# Altium project 191212 Temperature Sensors R0.PrjPcb
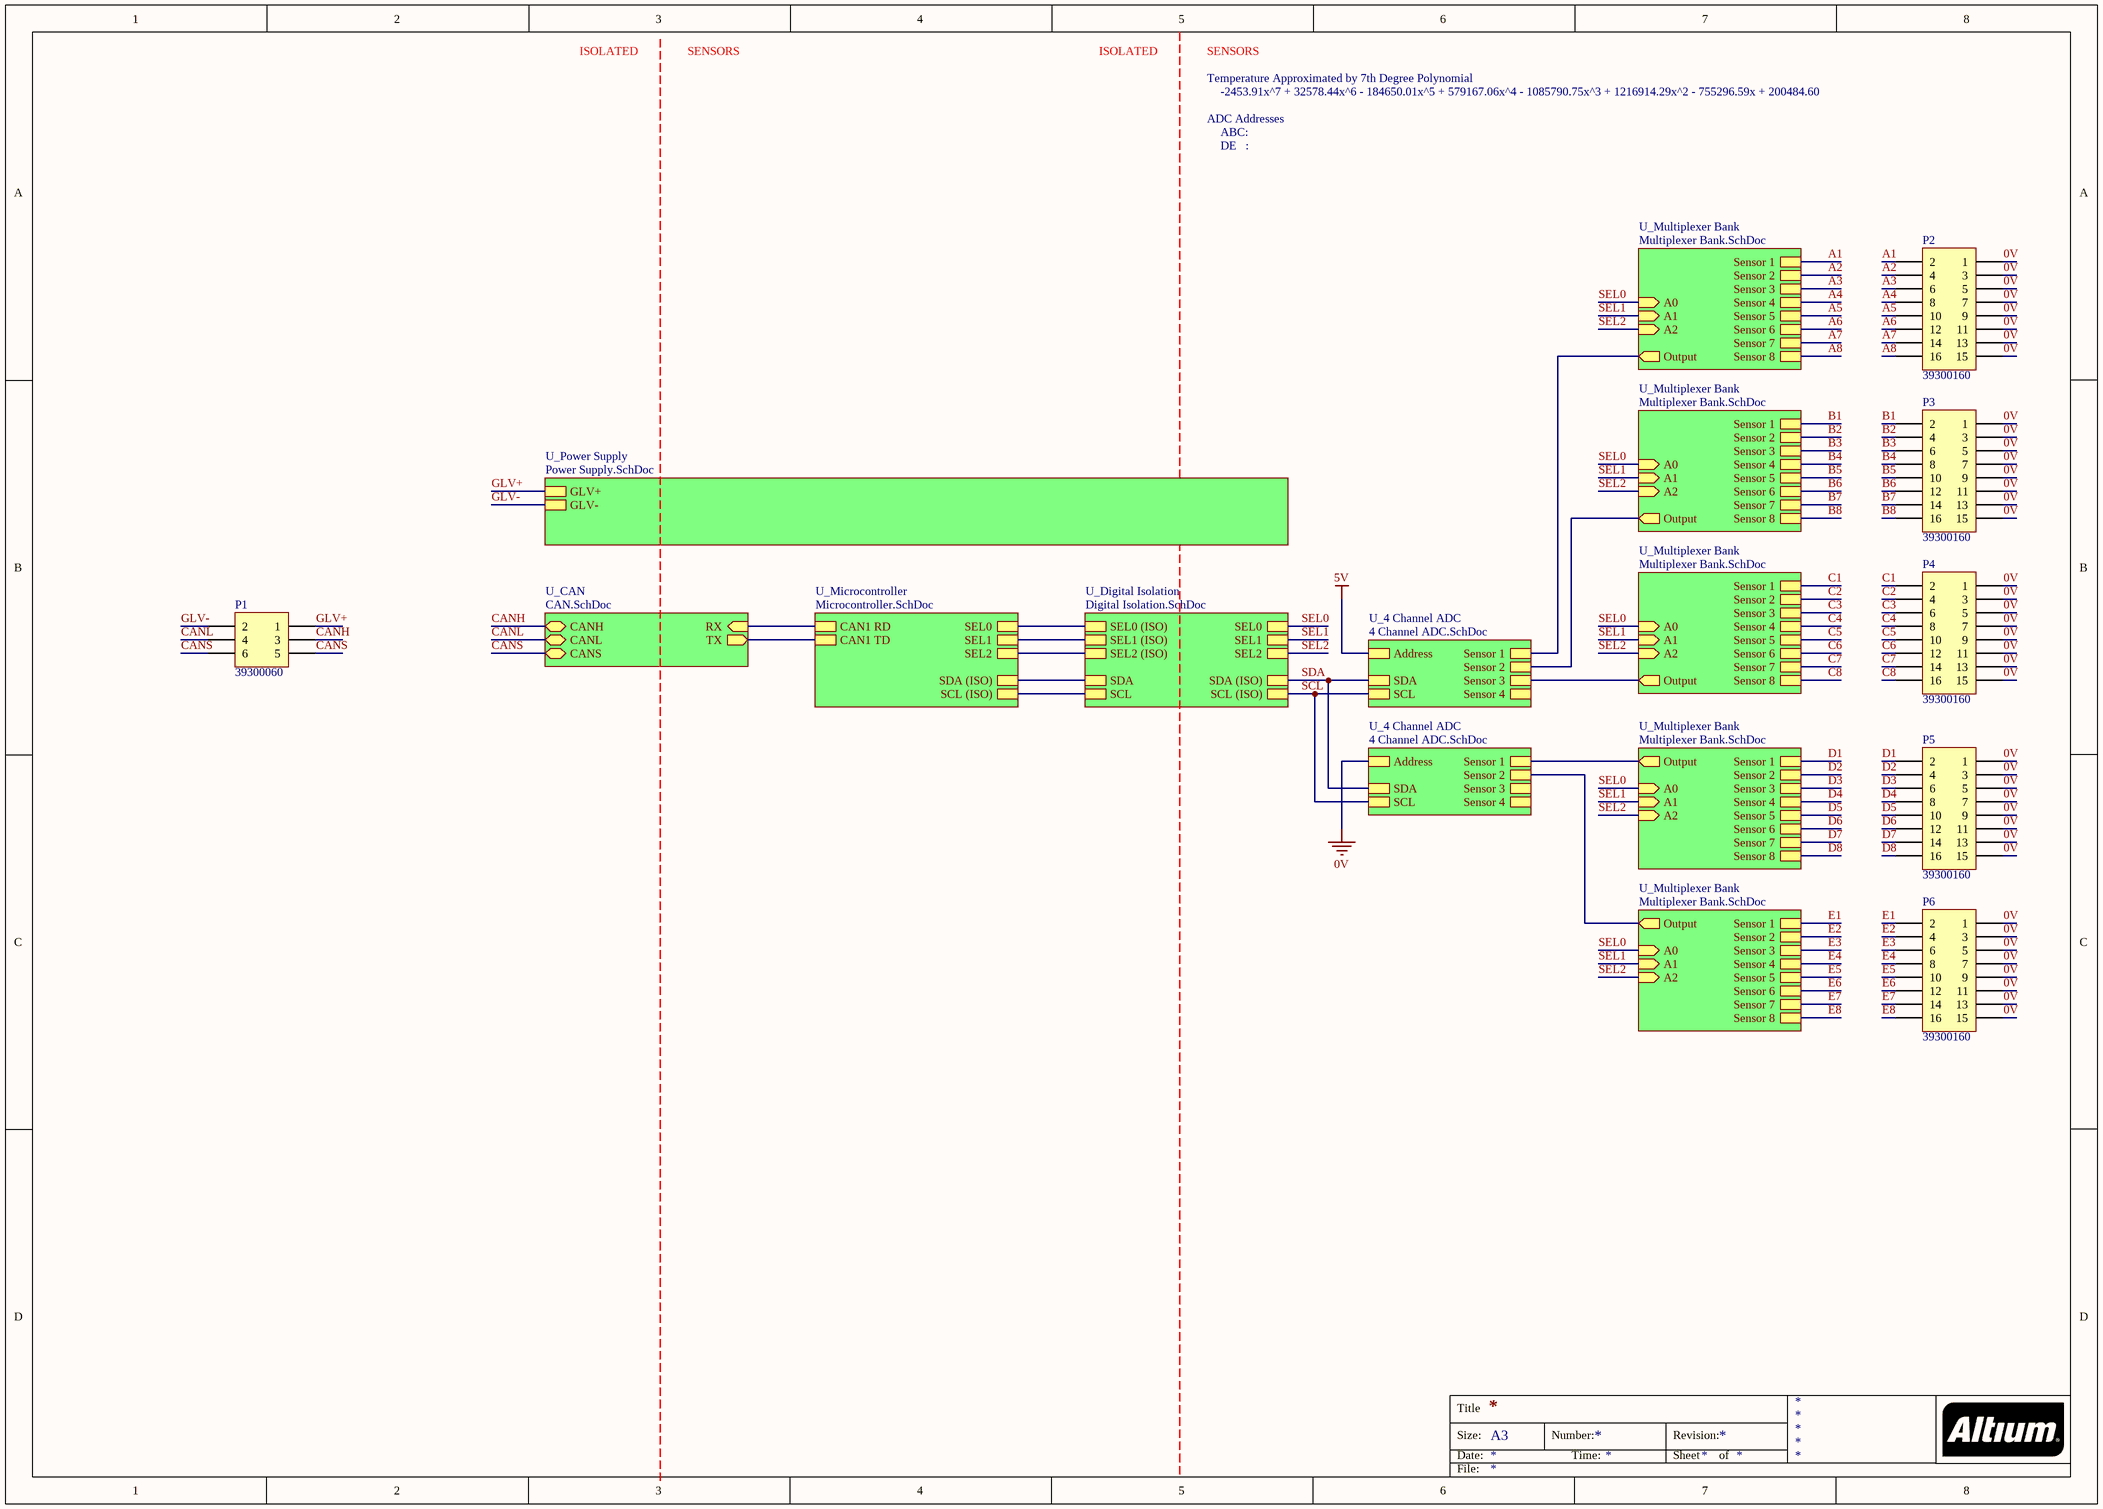
[diagram p0: Top Level.SchDoc]
6 sheets, 183 parts. Net scope: hierarchical (ports join the sheet entries above them; power ports are global).
Board file: 191230 PCB.PcbDoc
Sheets:
  Top Level.SchDoc
    U_4 Channel ADC = 4 Channel ADC.SchDoc
    U_Multiplexer Bank = Multiplexer Bank.SchDoc
    U_Multiplexer Bank = Multiplexer Bank.SchDoc
    U_Multiplexer Bank = Multiplexer Bank.SchDoc
    U_Multiplexer Bank = Multiplexer Bank.SchDoc
    U_Multiplexer Bank = Multiplexer Bank.SchDoc
    U_4 Channel ADC = 4 Channel ADC.SchDoc
    U_Digital Isolation = Digital Isolation.SchDoc
    U_Microcontroller = Microcontroller.SchDoc
    U_Power Supply = Power Supply.SchDoc

## Sheet Top Level.SchDoc
size A3

### Parts
P1  39300060  [39300060]
P2  39300160  [39300160]
P3  39300160  [39300160]
P4  39300160  [39300160]
P5  39300160  [39300160]
P6  39300160  [39300160]

### Sub-sheets
U_4 Channel ADC = 4 Channel ADC.SchDoc: Address, SCL, SDA, Sensor 1, Sensor 2, Sensor 3, Sensor 4
U_4 Channel ADC = 4 Channel ADC.SchDoc: Address, SCL, SDA, Sensor 1, Sensor 2, Sensor 3, Sensor 4
U_CAN = CAN.SchDoc (file not in this document): RX (in), TX (out), CANS (bidir), CANL (bidir), CANH (bidir)
U_Digital Isolation = Digital Isolation.SchDoc: SDA (ISO), SCL (ISO), SDA, SCL, SEL0 (ISO), SEL2 (ISO), SEL1 (ISO), SEL0, SEL2, SEL1
U_Microcontroller = Microcontroller.SchDoc: CAN1 RD, CAN1 TD, SDA (ISO), SCL (ISO), SEL0, SEL1, SEL2
U_Multiplexer Bank = Multiplexer Bank.SchDoc: Output (out), Sensor 7, Sensor 1, Sensor 2, Sensor 3, Sensor 4, Sensor 5, Sensor 6, Sensor 8, A0 (in), A1 (in), A2 (in)
U_Multiplexer Bank = Multiplexer Bank.SchDoc: Output (out), Sensor 7, Sensor 1, Sensor 2, Sensor 3, Sensor 4, Sensor 5, Sensor 6, Sensor 8, A0 (in), A1 (in), A2 (in)
U_Multiplexer Bank = Multiplexer Bank.SchDoc: Output (out), Sensor 7, Sensor 1, Sensor 2, Sensor 3, Sensor 4, Sensor 5, Sensor 6, Sensor 8, A0 (in), A1 (in), A2 (in)
U_Multiplexer Bank = Multiplexer Bank.SchDoc: Output (out), Sensor 7, Sensor 1, Sensor 2, Sensor 3, Sensor 4, Sensor 5, Sensor 6, Sensor 8, A0 (in), A1 (in), A2 (in)
U_Multiplexer Bank = Multiplexer Bank.SchDoc: Output (out), Sensor 7, Sensor 1, Sensor 2, Sensor 3, Sensor 4, Sensor 5, Sensor 6, Sensor 8, A0 (in), A1 (in), A2 (in)
U_Power Supply = Power Supply.SchDoc: GLV+, GLV-

### Nets
0V: P2.1 P2.3 P2.5 P2.7 P2.9 P2.11 P2.13 P2.15 P3.1 P3.3 P3.5 P3.7 P3.9 P3.11 P3.13 P3.15 P4.1 P4.3 P4.5 P4.7 P4.9 P4.11 P4.13 P4.15 P5.1 P5.3 P5.5 P5.7 P5.9 P5.11 P5.13 P5.15 P6.1 P6.3 P6.5 P6.7 P6.9 P6.11 P6.13 P6.15 ; sheet U_4 Channel ADC/Address
A1: P2.2 ; sheet U_Multiplexer Bank/Sensor 1
A2: P2.4 ; sheet U_Multiplexer Bank/Sensor 2
A3: P2.6 ; sheet U_Multiplexer Bank/Sensor 3
A4: P2.8 ; sheet U_Multiplexer Bank/Sensor 4
A5: P2.10 ; sheet U_Multiplexer Bank/Sensor 5
A6: P2.12 ; sheet U_Multiplexer Bank/Sensor 6
A7: P2.14 ; sheet U_Multiplexer Bank/Sensor 7
A8: P2.16 ; sheet U_Multiplexer Bank/Sensor 8
B1: P3.2 ; sheet U_Multiplexer Bank/Sensor 1
B2: P3.4 ; sheet U_Multiplexer Bank/Sensor 2
B3: P3.6 ; sheet U_Multiplexer Bank/Sensor 3
B4: P3.8 ; sheet U_Multiplexer Bank/Sensor 4
B5: P3.10 ; sheet U_Multiplexer Bank/Sensor 5
B6: P3.12 ; sheet U_Multiplexer Bank/Sensor 6
B7: P3.14 ; sheet U_Multiplexer Bank/Sensor 7
B8: P3.16 ; sheet U_Multiplexer Bank/Sensor 8
C1: P4.2 ; sheet U_Multiplexer Bank/Sensor 1
C2: P4.4 ; sheet U_Multiplexer Bank/Sensor 2
C3: P4.6 ; sheet U_Multiplexer Bank/Sensor 3
C4: P4.8 ; sheet U_Multiplexer Bank/Sensor 4
C5: P4.10 ; sheet U_Multiplexer Bank/Sensor 5
C6: P4.12 ; sheet U_Multiplexer Bank/Sensor 6
C7: P4.14 ; sheet U_Multiplexer Bank/Sensor 7
C8: P4.16 ; sheet U_Multiplexer Bank/Sensor 8
CANH: P1.3 ; sheet U_CAN/CANH
CANL: P1.4 ; sheet U_CAN/CANL
CANS: P1.5 P1.6 ; sheet U_CAN/CANS
D1: P5.2 ; sheet U_Multiplexer Bank/Sensor 1
D2: P5.4 ; sheet U_Multiplexer Bank/Sensor 2
D3: P5.6 ; sheet U_Multiplexer Bank/Sensor 3
D4: P5.8 ; sheet U_Multiplexer Bank/Sensor 4
D5: P5.10 ; sheet U_Multiplexer Bank/Sensor 5
D6: P5.12 ; sheet U_Multiplexer Bank/Sensor 6
D7: P5.14 ; sheet U_Multiplexer Bank/Sensor 7
D8: P5.16 ; sheet U_Multiplexer Bank/Sensor 8
E1: P6.2 ; sheet U_Multiplexer Bank/Sensor 1
E2: P6.4 ; sheet U_Multiplexer Bank/Sensor 2
E3: P6.6 ; sheet U_Multiplexer Bank/Sensor 3
E4: P6.8 ; sheet U_Multiplexer Bank/Sensor 4
E5: P6.10 ; sheet U_Multiplexer Bank/Sensor 5
E6: P6.12 ; sheet U_Multiplexer Bank/Sensor 6
E7: P6.14 ; sheet U_Multiplexer Bank/Sensor 7
E8: P6.16 ; sheet U_Multiplexer Bank/Sensor 8
GLV+: P1.1 ; sheet U_Power Supply/GLV+
GLV-: P1.2 ; sheet U_Power Supply/GLV-
PB6: sheet U_Digital Isolation/SCL, sheet U_Microcontroller/SCL (ISO)
PB7: sheet U_Digital Isolation/SDA, sheet U_Microcontroller/SDA (ISO)
PB8: sheet U_CAN/RX, sheet U_Microcontroller/CAN1 RD
PB9: sheet U_CAN/TX, sheet U_Microcontroller/CAN1 TD
PB13: sheet U_Digital Isolation/SEL0 (ISO), sheet U_Microcontroller/SEL0
PB14: sheet U_Digital Isolation/SEL1 (ISO), sheet U_Microcontroller/SEL1
PB15: sheet U_Digital Isolation/SEL2 (ISO), sheet U_Microcontroller/SEL2
SCL: sheet U_4 Channel ADC/SCL, sheet U_4 Channel ADC/SCL, sheet U_Digital Isolation/SCL (ISO)
SDA: sheet U_4 Channel ADC/SDA, sheet U_4 Channel ADC/SDA, sheet U_Digital Isolation/SDA (ISO)
SEL0: sheet U_Multiplexer Bank/A0, sheet U_Multiplexer Bank/A0, sheet U_Multiplexer Bank/A0, sheet U_Multiplexer Bank/A0, sheet U_Multiplexer Bank/A0, sheet U_Digital Isolation/SEL0
SEL1: sheet U_Multiplexer Bank/A1, sheet U_Multiplexer Bank/A1, sheet U_Multiplexer Bank/A1, sheet U_Multiplexer Bank/A1, sheet U_Multiplexer Bank/A1, sheet U_Digital Isolation/SEL1
SEL2: sheet U_Multiplexer Bank/A2, sheet U_Multiplexer Bank/A2, sheet U_Multiplexer Bank/A2, sheet U_Multiplexer Bank/A2, sheet U_Multiplexer Bank/A2, sheet U_Digital Isolation/SEL2
NetMUX_TP1_U_Multiplexer_Bank#1_1: sheet U_4 Channel ADC/Sensor 2, sheet U_Multiplexer Bank/Output
NetMUX_TP1_U_Multiplexer_Bank#2_1: sheet U_Multiplexer Bank/Output, sheet U_4 Channel ADC/Sensor 1
NetMUX_TP1_U_Multiplexer_Bank#3_1: sheet U_Multiplexer Bank/Output, sheet U_4 Channel ADC/Sensor 2
NetMUX_TP1_U_Multiplexer_Bank#4_1: sheet U_Multiplexer Bank/Output, sheet U_4 Channel ADC/Sensor 3
NetMUX_TP1_U_Multiplexer_Bank#5_1: sheet U_4 Channel ADC/Sensor 1, sheet U_Multiplexer Bank/Output

### Notes on the sheet
- ISOLATED
- SENSORS
- Temperature Approximated by 7th Degree Polynomial
- -2453.91x^7 + 32578.44x^6 - 184650.01x^5 + 579167.06x^4 - 1085790.75x^3 + 1216914.29x^2 - 755296.59x + 200484.60
- ADC Addresses
- ABC:
- DE   :
- Title
- Size:
- Date:
- A3
- Number:
- Time:
- Revision:
- Sheet
- of
- File:

### Library data of the parts
P1 = 39300060: Positions: 6; Pitch: 4.2mm; Row Spacing: 5.5mm; Angle: 90; Flange: No; Contact: Tin; Part Number: 39300060; Digikey Part Number: WM21353-ND
P2-P6 = 39300160: Positions: 16; Pitch: 4.2mm; Row Spacing: 5.5mm; Angle: 90; Flange: No; Contact: Tin; Part Number: 39300160; Digikey Part Number: WM21358-ND

## Sheet 4 Channel ADC.SchDoc
size A4
Used 2 times, as channels U_4 Channel ADC, U_4 Channel ADC. Parts and nets are listed once, with the designators drawn on the sheet.
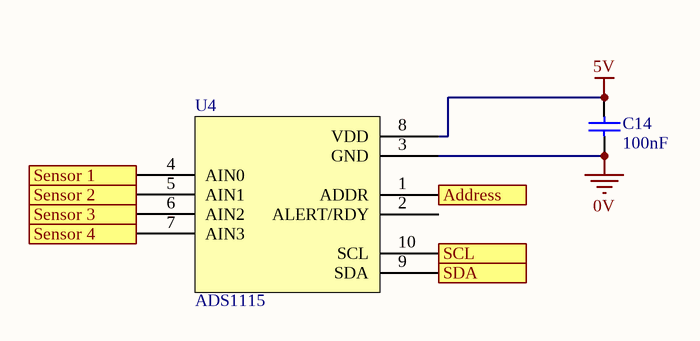
[diagram p1: 4 Channel ADC.SchDoc]

### Parts
C14  100nF  [0805]
U4  ADS1115  [TI 10-VSSOP]

### Ports
Address, SCL, SDA, Sensor 1, Sensor 2, Sensor 3, Sensor 4

### Nets
0V: C14.1 U4.3(GND)
5V: C14.2 U4.8(VDD)
Address: U4.1(ADDR) ; port Address
SCL: U4.10(SCL) ; port SCL
SDA: U4.9(SDA) ; port SDA
Sensor 1: U4.4(AIN0) ; port Sensor 1
Sensor 2: U4.5(AIN1) ; port Sensor 2
Sensor 3: U4.6(AIN2) ; port Sensor 3
Sensor 4: U4.7(AIN3) ; port Sensor 4

Not connected (* = marked no-connect by the designer): U4 2(ALERT/RDY)

### Channels
U_4 Channel ADC: designators end in _U_4_Channel_ADC#1; ports Address=0V SCL=SCL SDA=SDA Sensor 1=NetMUX_TP1_U_Multiplexer_Bank#5_1 Sensor 2=NetMUX_TP1_U_Multiplexer_Bank#1_1 Sensor 3=NetU4_U_4_Channel_ADC#1_6 Sensor 4=NetU4_U_4_Channel_ADC#1_7
U_4 Channel ADC: designators end in _U_4_Channel_ADC#2; ports Address=5V SCL=SCL SDA=SDA Sensor 1=NetMUX_TP1_U_Multiplexer_Bank#2_1 Sensor 2=NetMUX_TP1_U_Multiplexer_Bank#3_1 Sensor 3=NetMUX_TP1_U_Multiplexer_Bank#4_1 Sensor 4=NetU4_U_4_Channel_ADC#2_7

### Library data of the parts
C14 = GCM21BR71E104KA37L: Manufacturer: muRata; Tolerance: 10%; Material: X7R; Rated Voltage: 25V; Part Number: GCM21BR71E104KA37L; Value: 100nF
U4 = ADS1115: 16 Bit Analog to Digital Converter 2, 4 Input 1 Sigma-Delta 10-VSSOP; Manufacturer: Texas Instruments; Part Number: ADS1115; Digikey Part Number: 296-38849-1-ND; Digikey Link: https://www.digikey.com/product-detail/en/texas-instruments/ADS1115IDGSR/296-38849-1-ND/5142969

## Sheet Multiplexer Bank.SchDoc
size A4
Used 5 times, as channels U_Multiplexer Bank, U_Multiplexer Bank, U_Multiplexer Bank, U_Multiplexer Bank, U_Multiplexer Bank. Parts and nets are listed once, with the designators drawn on the sheet.
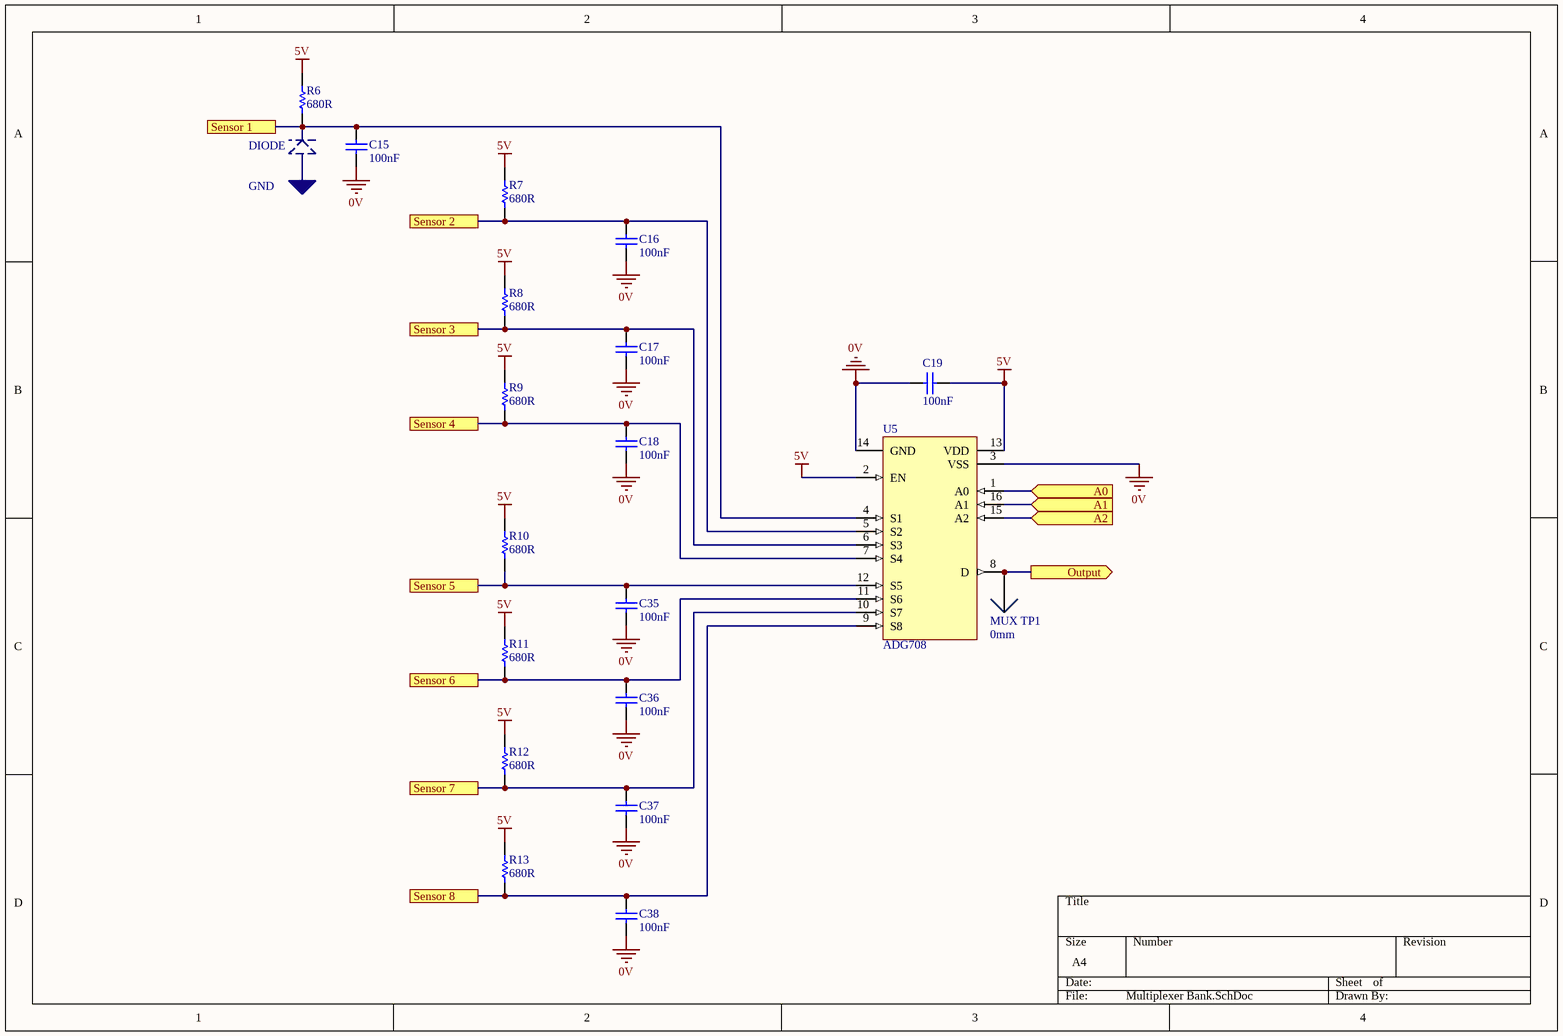
[diagram p2: Multiplexer Bank.SchDoc]

### Parts
C15  100nF  [0805]
C16  100nF  [0805]
C17  100nF  [0805]
C18  100nF  [0805]
C19  100nF  [0805]
C35  100nF  [0805]
C36  100nF  [0805]
C37  100nF  [0805]
C38  100nF  [0805]
MUX_TP1  0mm  [SMD Test Point]
R6  680R  [0805]
R7  680R  [0805]
R8  680R  [0805]
R9  680R  [0805]
R10  680R  [0805]
R11  680R  [0805]
R12  680R  [0805]
R13  680R  [0805]
U5  ADG708  [AD 16-TSSOP]

### Ports
A0 (in), A1 (in), A2 (in), Output (out), Sensor 1, Sensor 2, Sensor 3, Sensor 4, Sensor 5, Sensor 6, Sensor 7, Sensor 8

### Nets
0V: C15.1 C16.1 C17.1 C18.1 C19.1 C35.1 C36.1 C37.1 C38.1 U5.3(VSS) U5.14(GND)
5V: C19.2 R6.2 R7.2 R8.2 R9.2 R10.2 R11.2 R12.2 R13.2 U5.2(EN) U5.13(VDD)
A0: U5.1(A0) ; port A0
A1: U5.16(A1) ; port A1
A2: U5.15(A2) ; port A2
Output: MUX_TP1.1 U5.8(D) ; port Output
Sensor 1: C15.2 R6.1 U5.4(S1) ; port Sensor 1
Sensor 2: C16.2 R7.1 U5.5(S2) ; port Sensor 2
Sensor 3: C17.2 R8.1 U5.6(S3) ; port Sensor 3
Sensor 4: C18.2 R9.1 U5.7(S4) ; port Sensor 4
Sensor 5: C35.2 R10.1 U5.12(S5) ; port Sensor 5
Sensor 6: C36.2 R11.1 U5.11(S6) ; port Sensor 6
Sensor 7: C37.2 R12.1 U5.10(S7) ; port Sensor 7
Sensor 8: C38.2 R13.1 U5.9(S8) ; port Sensor 8

### Channels
U_Multiplexer Bank: designators C15=C15_U_Multiplexer_Bank#1 C16=C16_U_Multiplexer_Bank#1 C17=C17_U_Multiplexer_Bank#1 C18=C18_U_Multiplexer_Bank#1 C19=C19_U_Multiplexer_Bank#1 C35=C35_U_Multiplexer_Bank#1 C36=C36_U_Multiplexer_Bank#1 C37=C37_U_Multiplexer_Bank#1 C38=C38_U_Multiplexer_Bank#1 MUX TP1=MUX_TP1_U_Multiplexer_Bank#1 R6=R6_U_Multiplexer_Bank#1 R7=R7_U_Multiplexer_Bank#1 R8=R8_U_Multiplexer_Bank#1 R9=R9_U_Multiplexer_Bank#1 R10=R10_U_Multiplexer_Bank#1 R11=R11_U_Multiplexer_Bank#1 R12=R12_U_Multiplexer_Bank#1 R13=R13_U_Multiplexer_Bank#1 U5=U5_U_Multiplexer_Bank#1; ports A0=SEL0 A1=SEL1 A2=SEL2 Output=NetMUX_TP1_U_Multiplexer_Bank#1_1 Sensor 1=E1 Sensor 2=E2 Sensor 3=E3 Sensor 4=E4 Sensor 5=E5 Sensor 6=E6 Sensor 7=E7 Sensor 8=E8
U_Multiplexer Bank: designators C15=C15_U_Multiplexer_Bank#2 C16=C16_U_Multiplexer_Bank#2 C17=C17_U_Multiplexer_Bank#2 C18=C18_U_Multiplexer_Bank#2 C19=C19_U_Multiplexer_Bank#2 C35=C35_U_Multiplexer_Bank#2 C36=C36_U_Multiplexer_Bank#2 C37=C37_U_Multiplexer_Bank#2 C38=C38_U_Multiplexer_Bank#2 MUX TP1=MUX_TP1_U_Multiplexer_Bank#2 R6=R6_U_Multiplexer_Bank#2 R7=R7_U_Multiplexer_Bank#2 R8=R8_U_Multiplexer_Bank#2 R9=R9_U_Multiplexer_Bank#2 R10=R10_U_Multiplexer_Bank#2 R11=R11_U_Multiplexer_Bank#2 R12=R12_U_Multiplexer_Bank#2 R13=R13_U_Multiplexer_Bank#2 U5=U5_U_Multiplexer_Bank#2; ports A0=SEL0 A1=SEL1 A2=SEL2 Output=NetMUX_TP1_U_Multiplexer_Bank#2_1 Sensor 1=A1 Sensor 2=A2 Sensor 3=A3 Sensor 4=A4 Sensor 5=A5 Sensor 6=A6 Sensor 7=A7 Sensor 8=A8
U_Multiplexer Bank: designators C15=C15_U_Multiplexer_Bank#3 C16=C16_U_Multiplexer_Bank#3 C17=C17_U_Multiplexer_Bank#3 C18=C18_U_Multiplexer_Bank#3 C19=C19_U_Multiplexer_Bank#3 C35=C35_U_Multiplexer_Bank#3 C36=C36_U_Multiplexer_Bank#3 C37=C37_U_Multiplexer_Bank#3 C38=C38_U_Multiplexer_Bank#3 MUX TP1=MUX_TP1_U_Multiplexer_Bank#3 R6=R6_U_Multiplexer_Bank#3 R7=R7_U_Multiplexer_Bank#3 R8=R8_U_Multiplexer_Bank#3 R9=R9_U_Multiplexer_Bank#3 R10=R10_U_Multiplexer_Bank#3 R11=R11_U_Multiplexer_Bank#3 R12=R12_U_Multiplexer_Bank#3 R13=R13_U_Multiplexer_Bank#3 U5=U5_U_Multiplexer_Bank#3; ports A0=SEL0 A1=SEL1 A2=SEL2 Output=NetMUX_TP1_U_Multiplexer_Bank#3_1 Sensor 1=B1 Sensor 2=B2 Sensor 3=B3 Sensor 4=B4 Sensor 5=B5 Sensor 6=B6 Sensor 7=B7 Sensor 8=B8
U_Multiplexer Bank: designators C15=C15_U_Multiplexer_Bank#4 C16=C16_U_Multiplexer_Bank#4 C17=C17_U_Multiplexer_Bank#4 C18=C18_U_Multiplexer_Bank#4 C19=C19_U_Multiplexer_Bank#4 C35=C35_U_Multiplexer_Bank#4 C36=C36_U_Multiplexer_Bank#4 C37=C37_U_Multiplexer_Bank#4 C38=C38_U_Multiplexer_Bank#4 MUX TP1=MUX_TP1_U_Multiplexer_Bank#4 R6=R6_U_Multiplexer_Bank#4 R7=R7_U_Multiplexer_Bank#4 R8=R8_U_Multiplexer_Bank#4 R9=R9_U_Multiplexer_Bank#4 R10=R10_U_Multiplexer_Bank#4 R11=R11_U_Multiplexer_Bank#4 R12=R12_U_Multiplexer_Bank#4 R13=R13_U_Multiplexer_Bank#4 U5=U5_U_Multiplexer_Bank#4; ports A0=SEL0 A1=SEL1 A2=SEL2 Output=NetMUX_TP1_U_Multiplexer_Bank#4_1 Sensor 1=C1 Sensor 2=C2 Sensor 3=C3 Sensor 4=C4 Sensor 5=C5 Sensor 6=C6 Sensor 7=C7 Sensor 8=C8
U_Multiplexer Bank: designators C15=C15_U_Multiplexer_Bank#5 C16=C16_U_Multiplexer_Bank#5 C17=C17_U_Multiplexer_Bank#5 C18=C18_U_Multiplexer_Bank#5 C19=C19_U_Multiplexer_Bank#5 C35=C35_U_Multiplexer_Bank#5 C36=C36_U_Multiplexer_Bank#5 C37=C37_U_Multiplexer_Bank#5 C38=C38_U_Multiplexer_Bank#5 MUX TP1=MUX_TP1_U_Multiplexer_Bank#5 R6=R6_U_Multiplexer_Bank#5 R7=R7_U_Multiplexer_Bank#5 R8=R8_U_Multiplexer_Bank#5 R9=R9_U_Multiplexer_Bank#5 R10=R10_U_Multiplexer_Bank#5 R11=R11_U_Multiplexer_Bank#5 R12=R12_U_Multiplexer_Bank#5 R13=R13_U_Multiplexer_Bank#5 U5=U5_U_Multiplexer_Bank#5; ports A0=SEL0 A1=SEL1 A2=SEL2 Output=NetMUX_TP1_U_Multiplexer_Bank#5_1 Sensor 1=D1 Sensor 2=D2 Sensor 3=D3 Sensor 4=D4 Sensor 5=D5 Sensor 6=D6 Sensor 7=D7 Sensor 8=D8

### Notes on the sheet
- (near R6) DIODE
- GND

### Library data of the parts
C15-C19 C35-C38 = GCM21BR71E104KA37L: as C14 on sheet 4 Channel ADC; Part Number: GCM21BR71E104KA37L; Value: 100nF
MUX_TP1 = SMD Test Point: Positions: 1; Row Spacing: 0; Flange: No; Contact: NA; Part Number: SMD Test Point; Pitch: 0mm; Angle: 0
R6-R13 = RC0805FR07680RL: Manufacturer: YAGEO; Tolerance: 0.01; Rated Voltage: 0.125W; Part Number: RC0805FR07680RL; Value: 680R; Material: FR-07
U5 = ADG708: 1 Circuit IC Switch 8:1 4.5Ohm 16-TSSOP; Manufacturer: Analog Devices; Part Number: ADG708; Digikey Part Number: ADG708BRUZ-ND; Digikey Link: https://www.digikey.com/product-detail/en/analog-devices-inc/ADG708BRUZ/ADG708BRUZ-ND/820104

## Sheet Digital Isolation.SchDoc
size A4
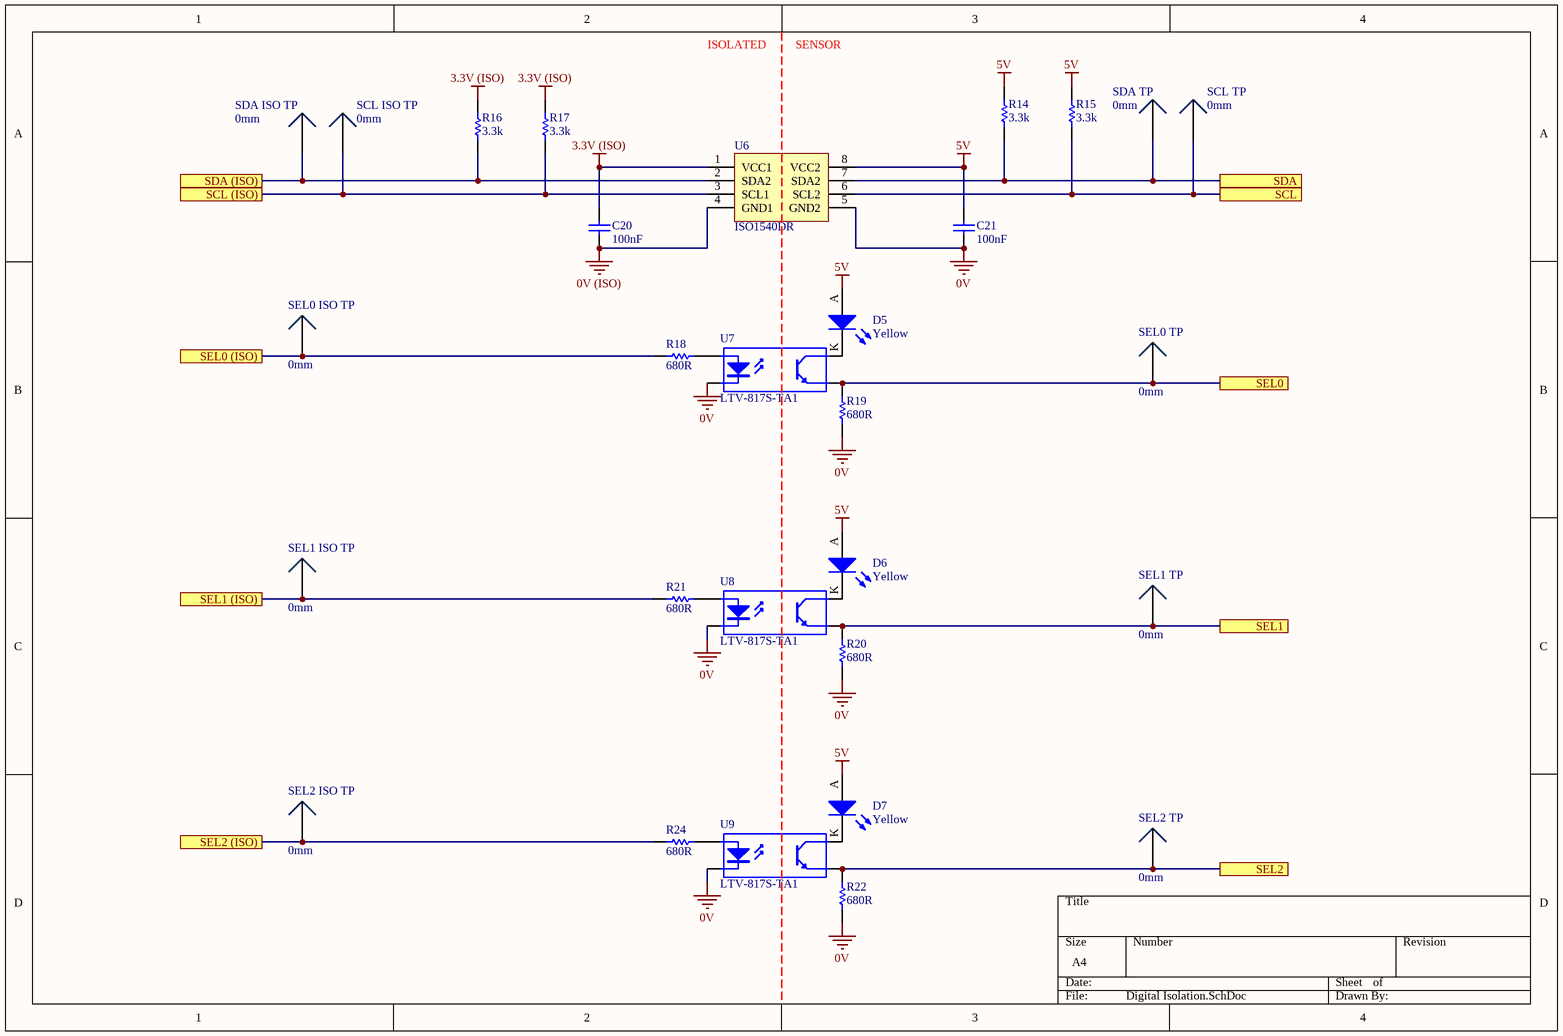
[diagram p3: Digital Isolation.SchDoc]

### Parts
C20  100nF  [0805]
C21  100nF  [0805]
D5  Yellow  [0805 LED]
D6  Yellow  [0805 LED]
D7  Yellow  [0805 LED]
R14  3.3k  [0805]
R15  3.3k  [0805]
R16  3.3k  [0805]
R17  3.3k  [0805]
R18  680R  [0805]
R19  680R  [0805]
R20  680R  [0805]
R21  680R  [0805]
R22  680R  [0805]
R24  680R  [0805]
SCL_ISO_TP  0mm  [SMD Test Point]
SCL_TP  0mm  [SMD Test Point]
SDA_ISO_TP  0mm  [SMD Test Point]
SDA_TP  0mm  [SMD Test Point]
SEL0_ISO_TP  0mm  [SMD Test Point]
SEL0_TP  0mm  [SMD Test Point]
SEL1_ISO_TP  0mm  [SMD Test Point]
SEL1_TP  0mm  [SMD Test Point]
SEL2_ISO_TP  0mm  [SMD Test Point]
SEL2_TP  0mm  [SMD Test Point]
U6  ISO1540DR  [TI 8-SOIC]
U7  LTV-817S-TA1  [ON 4-SMD]
U8  LTV-817S-TA1  [ON 4-SMD]
U9  LTV-817S-TA1  [ON 4-SMD]

### Ports
SCL, SCL (ISO), SDA, SDA (ISO), SEL0, SEL0 (ISO), SEL1, SEL1 (ISO), SEL2, SEL2 (ISO)

### Nets
0V: C21.1 R19.1 R20.1 R22.1 U6.5(GND2) U7.2(K) U8.2(K) U9.2(K)
0V (ISO): C20.1 U6.4(GND1)
3.3V (ISO): C20.2 R16.2 R17.2 U6.1(VCC1)
5V: C21.2 D5.A D6.A D7.A R14.2 R15.2 U6.8(VCC2)
PB6: R15.1 SCL_TP.1 U6.6(SCL2) ; port SCL
PB7: R14.1 SDA_TP.1 U6.7(SDA2) ; port SDA
PB13: R18.1 SEL0_ISO_TP.1 ; port SEL0 (ISO)
PB14: R21.1 SEL1_ISO_TP.1 ; port SEL1 (ISO)
PB15: R24.1 SEL2_ISO_TP.1 ; port SEL2 (ISO)
SCL: R17.1 SCL_ISO_TP.1 U6.3(SCL1) ; port SCL (ISO)
SDA: R16.1 SDA_ISO_TP.1 U6.2(SDA2) ; port SDA (ISO)
SEL0: R19.2 SEL0_TP.1 U7.3(E) ; port SEL0
SEL1: R20.2 SEL1_TP.1 U8.3(E) ; port SEL1
SEL2: R22.2 SEL2_TP.1 U9.3(E) ; port SEL2
NetD5_K: D5.K U7.4(C)
NetD6_K: D6.K U8.4(C)
NetD7_K: D7.K U9.4(C)
NetR18_2: R18.2 U7.1(A)
NetR21_2: R21.2 U8.1(A)
NetR24_2: R24.2 U9.1(A)

### Notes on the sheet
- ISOLATED
- SENSOR

### Library data of the parts
C20 C21 = GCM21BR71E104KA37L: as C14 on sheet 4 Channel ADC; Part Number: GCM21BR71E104KA37L; Value: 100nF
D5-D7 = SML-211YTT86: Yellow LED Indication - Discrete 1.75V 0805 (2012 Metric); Manufacturer: ROHM Semiconductor; Part Number: SML-211YTT86; Colour: Yellow; Digikey Part Number: 511-1293-1-ND; Digikey Link: https://www.digikey.com/product-detail/en/rohm-semiconductor/SML-211YTT86/511-1293-1-ND/637106
R14-R17 = RC0805FR073K3L: Manufacturer: YAGEO; Tolerance: 0.01; Rated Voltage: 0.125W; Part Number: RC0805FR073K3L; Value: 3.3k; Material: FR-07
R18-R22 R24 = RC0805FR07680RL: as R6 on sheet Multiplexer Bank; Part Number: RC0805FR07680RL; Value: 680R; Material: FR-07
SCL_ISO_TP SCL_TP SDA_ISO_TP SDA_TP SEL0_ISO_TP SEL0_TP SEL1_ISO_TP SEL1_TP SEL2_ISO_TP SEL2_TP = SMD Test Point: as MUX_TP1 on sheet Multiplexer Bank; Part Number: SMD Test Point; Pitch: 0mm; Angle: 0
U6 = ISO1540DR: I2C Digital Isolator (Multichannel); Manufacturer: Texas Instruments; Part Number: ISO1540DR; Digikey Part Number: 296-34871-1-ND; Digikey Link: https://www.digikey.com/product-detail/en/texas-instruments/ISO1540DR/296-34871-1-ND/3587214
U7-U9 = LTV-817S-TA1: 35V 50ma Optocoupler (VF=1.2V); Manufacturer: Lite-On Inc; Part Number: LTV-817S-TA1; Digikey Part Number: 160-1893-2-ND; Digikey Link: https://www.digikey.com/product-detail/en/lite-on-inc/LTV-817S-TA1/160-1893-2-ND/388451

## Sheet Microcontroller.SchDoc
size A3
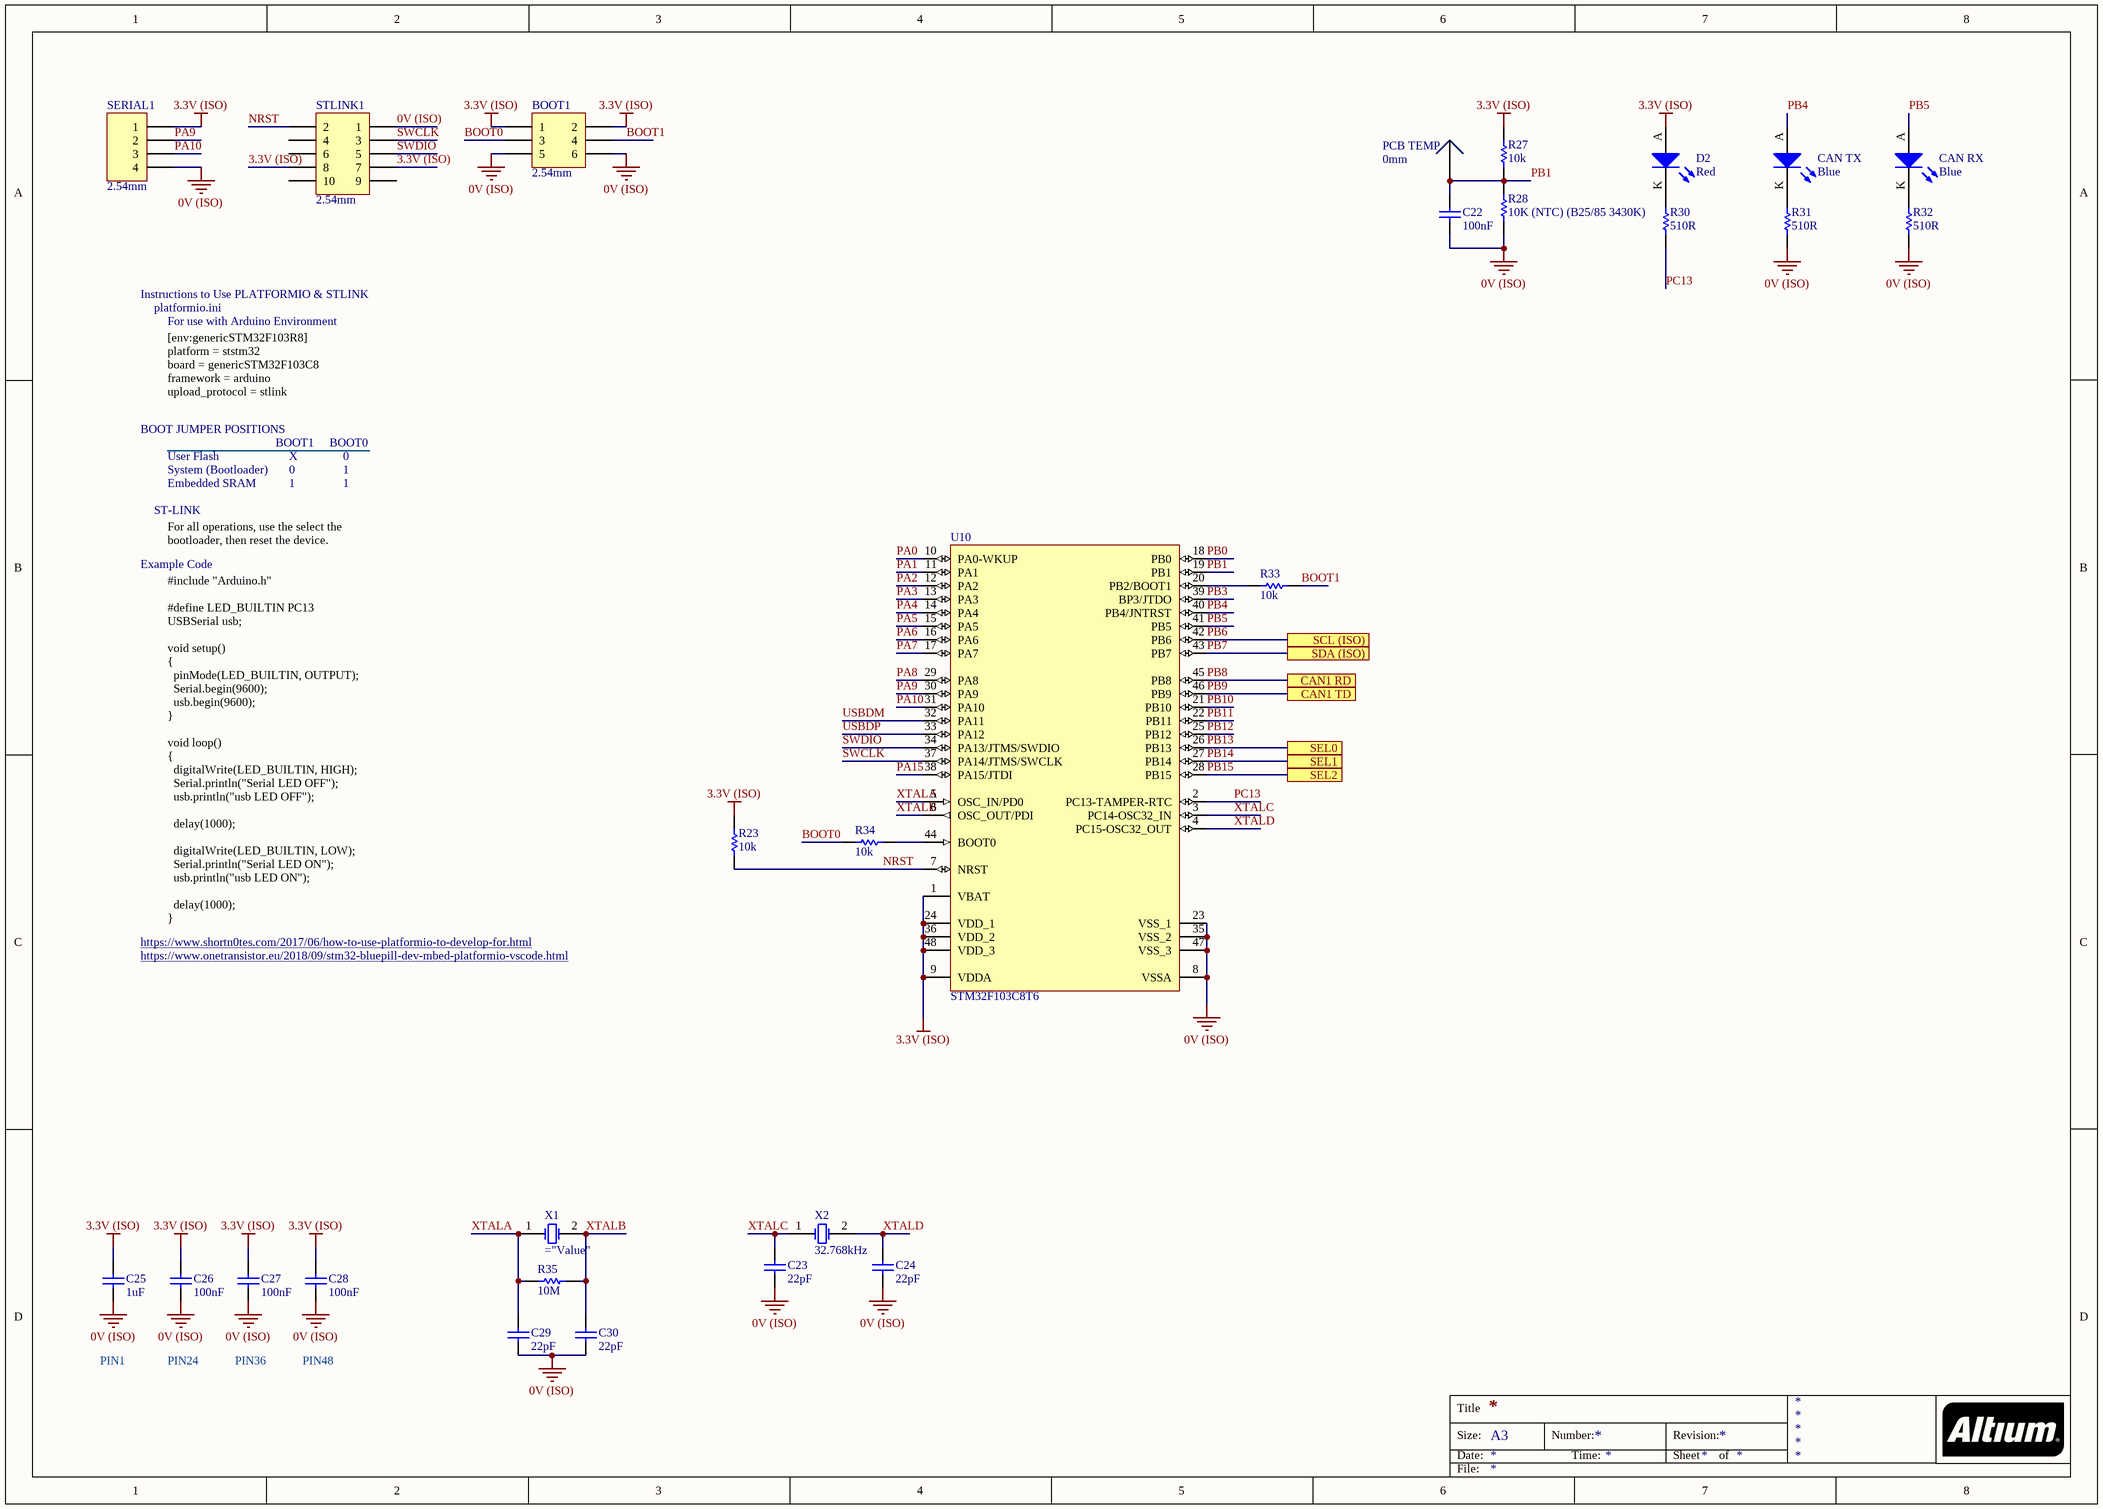
[diagram p4: Microcontroller.SchDoc]

### Parts
BOOT1  2.54mm  [TH 2.54mm Header 2x3]
C22  100nF  [0805]
C23  22pF  [0805]
C24  22pF  [0805]
C25  1uF  [0805]
C26  100nF  [0805]
C27  100nF  [0805]
C28  100nF  [0805]
C29  22pF  [0805]
C30  22pF  [0805]
CAN_RX  Blue  [0805 LED]
CAN_TX  Blue  [0805 LED]
D2  Red  [0805 LED]
PCB_TEMP  0mm  [SMD Test Point]
R23  10k  [0805]
R27  10k  [0805]
R28  10K (NTC) (B25/85 3430K)  [0805]
R30  510R  [0805]
R31  510R  [0805]
R32  510R  [0805]
R33  10k  [0805]
R34  10k  [0805]
R35  10M  [0805]
SERIAL1  2.54mm  [TH 2.54mm Header 1x4]
STLINK1  2.54mm  [TH 2.54mm Header 2x5]
U10  STM32F103C8T6  [STM 48-LQFP]
X1  (no value)  [Abracon HC-49/US]
X2  32.768kHz  [EPSON 2-SMD]

### Ports
CAN1 RD, CAN1 TD, SCL (ISO), SDA (ISO), SEL0, SEL1, SEL2

### Nets
0V (ISO): BOOT1.5 BOOT1.6 C22.1 C23.1 C24.1 C25.1 C26.1 C27.1 C28.1 C29.1 C30.1 R28.1 R31.1 R32.1 SERIAL1.4 STLINK1.1 U10.8(VSSA) U10.23(VSS_1) U10.35(VSS_2) U10.47(VSS_3)
3.3V (ISO): BOOT1.1 BOOT1.2 C25.2 C26.2 C27.2 C28.2 D2.A R23.2 R27.2 SERIAL1.1 STLINK1.7 STLINK1.8 U10.1(VBAT) U10.9(VDDA) U10.24(VDD_1) U10.36(VDD_2) U10.48(VDD_3)
BOOT0: BOOT1.3 R34.1
BOOT1: BOOT1.4 R33.2
NRST: R23.1 STLINK1.2 U10.7(NRST)
PA0: U10.10(PA0-WKUP)
PA1: U10.11(PA1)
PA2: U10.12(PA2)
PA3: U10.13(PA3)
PA4: U10.14(PA4)
PA5: U10.15(PA5)
PA6: U10.16(PA6)
PA7: U10.17(PA7)
PA8: U10.29(PA8)
PA9: SERIAL1.2 U10.30(PA9)
PA10: SERIAL1.3 U10.31(PA10)
PA15: U10.38(PA15/JTDI)
PB0: U10.18(PB0)
PB1: C22.2 PCB_TEMP.1 R27.1 R28.2 U10.19(PB1)
PB3: U10.39(BP3/JTDO)
PB4: CAN_TX.A U10.40(PB4/JNTRST)
PB5: CAN_RX.A U10.41(PB5)
PB6: U10.42(PB6) ; port SCL (ISO)
PB7: U10.43(PB7) ; port SDA (ISO)
PB8: U10.45(PB8) ; port CAN1 RD
PB9: U10.46(PB9) ; port CAN1 TD
PB10: U10.21(PB10)
PB11: U10.22(PB11)
PB12: U10.25(PB12)
PB13: U10.26(PB13) ; port SEL0
PB14: U10.27(PB14) ; port SEL1
PB15: U10.28(PB15) ; port SEL2
PC13: R30.1 U10.2(PC13-TAMPER-RTC)
SWCLK: STLINK1.3 U10.37(PA14/JTMS/SWCLK)
SWDIO: STLINK1.5 U10.34(PA13/JTMS/SWDIO)
USBDM: U10.32(PA11)
USBDP: U10.33(PA12)
XTALA: C29.2 R35.1 U10.5(OSC_IN/PD0) X1.1(OSC1)
XTALB: C30.2 R35.2 U10.6(OSC_OUT/PDI) X1.2(OSC2)
XTALC: C23.2 U10.3(PC14-OSC32_IN) X2.1(OSC1)
XTALD: C24.2 U10.4(PC15-OSC32_OUT) X2.2(OSC2)
NetCAN_RX_K: CAN_RX.K R32.2
NetCAN_TX_K: CAN_TX.K R31.2
NetD2_K: D2.K R30.2
NetR33_1: R33.1 U10.20(PB2/BOOT1)
NetR34_2: R34.2 U10.44(BOOT0)

Not connected (* = marked no-connect by the designer): STLINK1 4 6 9 10

### Notes on the sheet
- Instructions to Use PLATFORMIO & STLINK
- platformio.ini
- For use with Arduino Environment
- BOOT JUMPER POSITIONS
- [env:genericSTM32F103R8]
  platform = ststm32
  board = genericSTM32F103C8
  framework = arduino
  upload_protocol = stlink
- BOOT1
- BOOT0
- ST-LINK
- User Flash
- System (Bootloader)
- Embedded SRAM
- X
- 1
- 0
- Example Code
- For all operations, use the select the bootloader, then reset the device.
- #include "Arduino.h"
  #define LED_BUILTIN PC13
  USBSerial usb;
  void setup()
  {
  pinMode(LED_BUILTIN, OUTPUT);
  Serial.begin(9600);
  usb.begin(9600);
  }
  void loop()
  {
  digitalWrite(LED_BUILTIN, HIGH);
  Serial.println("Serial LED OFF");
  usb.println("usb LED OFF");
  delay(1000);
  digitalWrite(LED_BUILTIN, LOW);
  Serial.println("Serial LED ON");
  usb.println("usb LED ON");
  delay(1000);
  }
- https://www.shortn0tes.com/2017/06/how-to-use-platformio-to-develop-for.html
- https://www.onetransistor.eu/2018/09/stm32-bluepill-dev-mbed-platformio-vscode.html
- PIN1
- PIN24
- PIN36
- PIN48
- Title
- Size:
- Date:
- A3
- Number:
- Time:
- Revision:
- Sheet
- of
- File:

### Library data of the parts
BOOT1 = TH 2.54mm Header 2x3: Positions: 6; Angle: 0; Flange: No; Contact: NA; Part Number: TH 2.54mm Header 2x3; Pitch: 2.54mm; Row Spacing: 2.54mm
C22 C26-C28 = GCM21BR71E104KA37L: as C14 on sheet 4 Channel ADC; Part Number: GCM21BR71E104KA37L; Value: 100nF
C23 C24 C29 C30 = GCM21B5C1H220JA37L: Manufacturer: muRata; Tolerance: 5%; Material: C0G; Rated Voltage: 50V; Part Number: GCM21B5C1H220JA37L; Value: 22pF
C25 = GCM21BR71A105KA37L: Manufacturer: muRata; Tolerance: 10%; Material: X7R; Rated Voltage: 10V; Part Number: GCM21BR71A105KA37L; Value: 1uF
CAN_RX CAN_TX = SML-MN2BCTT86C: LED BLUE CLEAR 2012 SMD; Manufacturer: ROHM Semiconductor; Part Number: SML-MN2BCTT86C; Colour: Blue; Digikey Part Number: 846-1207-1-ND; Digikey Link: https://www.digikey.com/product-detail/en/rohm-semiconductor/SMLMN2BCTT86C/846-1207-1-ND/6057239
D2 = SML-210LTT86: Red LED Indication - Discrete 1.75V 0805 (2012 Metric); Manufacturer: ROHM Semiconductor; Part Number: SML-210LTT86; Colour: Red; Digikey Part Number: 511-1286-1-ND; Digikey Link: https://www.digikey.com/product-detail/en/rohm-semiconductor/SML-210LTT86/511-1286-1-ND/637099
PCB_TEMP = SMD Test Point: as MUX_TP1 on sheet Multiplexer Bank; Part Number: SMD Test Point; Pitch: 0mm; Angle: 0
R23 R27 R33 R34 = RC0805FR0710KL: Manufacturer: YAGEO; Tolerance: 0.01; Rated Voltage: 0.125W; Part Number: RC0805FR0710KL; Value: 10k; Material: FR-07
R28 = NTCS0805E3103FLT: Manufacturer: Vishay Beyschlag; Tolerance: 0.01; Rated Voltage: 210mW; Part Number: NTCS0805E3103FLT; Value: 10K (NTC) (B25/85 3430K); Digikey Part Number: BC2733CT-ND
R30-R32 = RC0805FR07510RL: Manufacturer: YAGEO; Tolerance: 0.01; Rated Voltage: 0.125W; Part Number: RC0805FR07510RL; Value: 510R; Material: FR-07
R35 = RC0805FR0710ML: Manufacturer: YAGEO; Tolerance: 0.01; Rated Voltage: 0.125W; Part Number: RC0805FR0710ML; Value: 10M; Material: FR-07
SERIAL1 = TH 2.54mm Header 1x4: Positions: 4; Angle: 0; Flange: No; Contact: NA; Part Number: TH 2.54mm Header 1x4; Pitch: 2.54mm; Row Spacing: 2.54mm
STLINK1 = TH 2.54mm Header 2x5: Positions: 10; Angle: 0; Flange: No; Contact: NA; Part Number: TH 2.54mm Header 2x5; Pitch: 2.54mm; Row Spacing: 2.54mm
U10 = STM32F103C8T6: ARM® Cortex®-M3 STM32F1 Microcontroller IC 32-Bit 72MHz 64KB (64K x 8) FLASH; Manufacturer: STMicroelectronics; Part Number: STM32F103C8T6; Digikey Part Number: 497-6063-ND; Digikey Link: https://www.digikey.com/product-detail/en/stmicroelectronics/STM32F103C8T6/497-6063-ND/1646338
X1 = ABLS-16.000MHZ-B4-T: Manufacturer: Abracon LLC; Load Capacitance: 18pF; ESR: 40R; Part Number: ABLS-16.000MHZ-B4-T; Digikey Part Number: 535-10226-1-ND; Digikey Link: https://www.digikey.com/product-detail/en/abracon-llc/ABLS-16.000MHZ-B4-T/535-10226-1-ND/2184261
X2 = FC-135 32.7680KA-A5: Manufacturer: EPSON; Load Capacitance: 12.5pF; ESR: 70k; Part Number: FC-135 32.7680KA-A5; Value: 32.768kHz; Digikey Part Number: SER4103TR-ND; Digikey Link: https://www.digikey.com/product-detail/en/epson/FC-135-32.7680KA-A5/SER4103TR-ND/5259895

## Sheet Power Supply.SchDoc
size A4
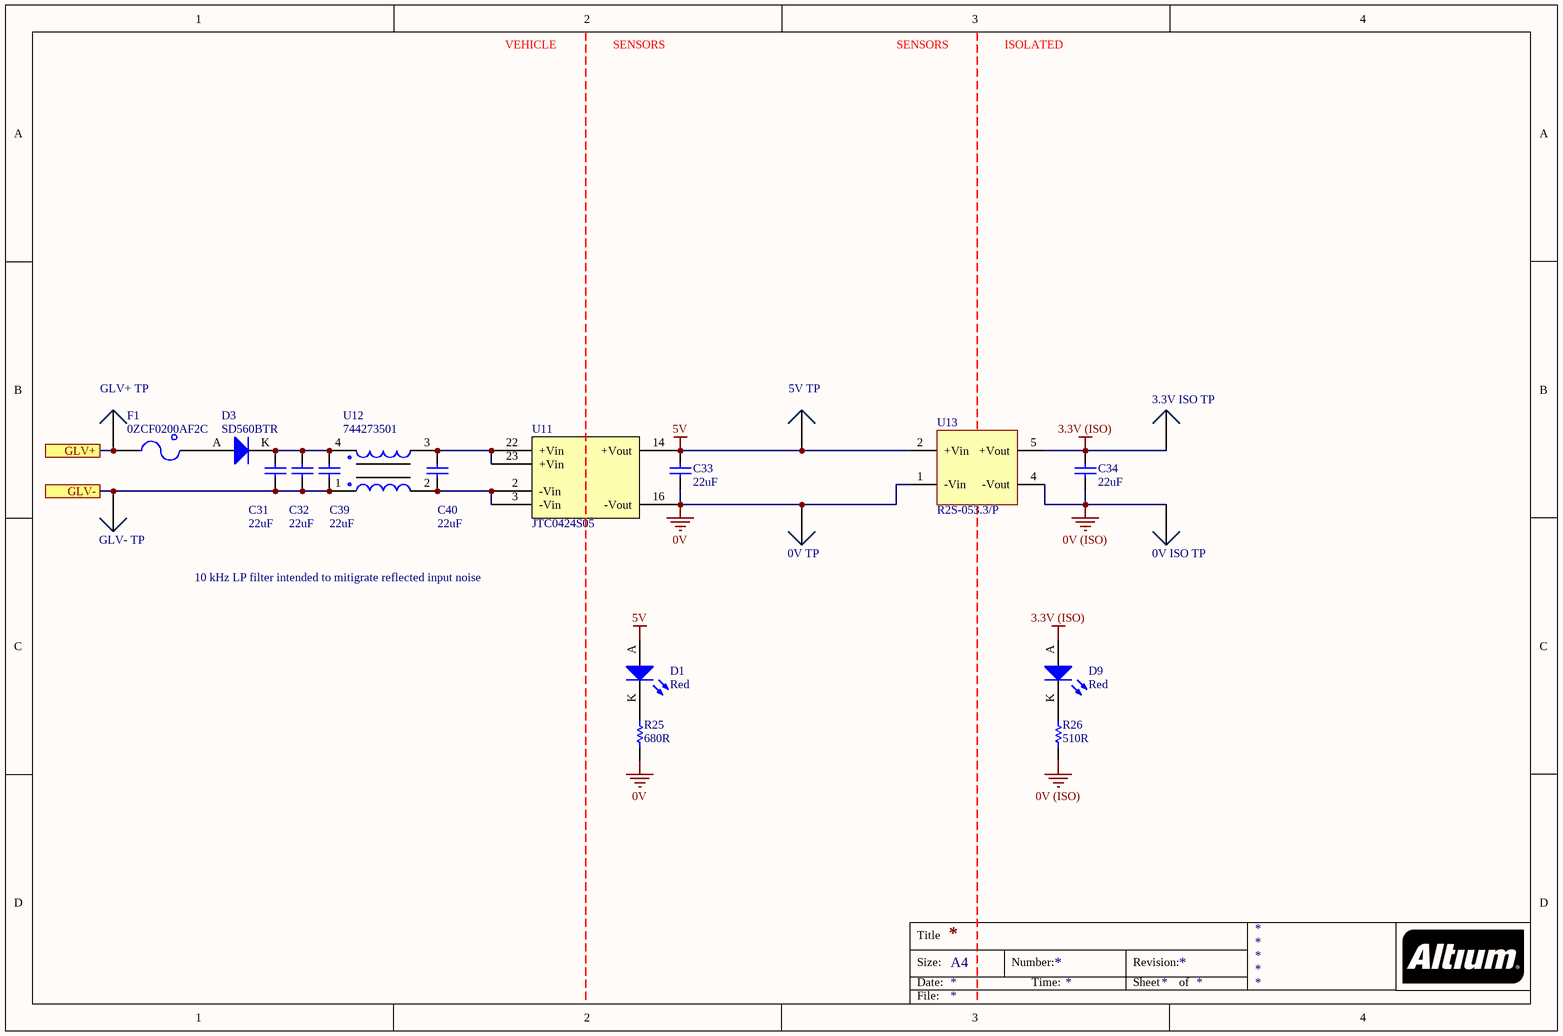
[diagram p5: Power Supply.SchDoc]

### Parts
0V_ISO_TP  0mm  [SMD Test Point]  (value not drawn)
0V_TP  0mm  [SMD Test Point]  (value not drawn)
3.3V_ISO_TP  0mm  [SMD Test Point]  (value not drawn)
5V_TP  0mm  [SMD Test Point]  (value not drawn)
C31  22uF  [1206]
C32  22uF  [1206]
C33  22uF  [1206]
C34  22uF  [1206]
C39  22uF  [1206]
C40  22uF  [1206]
D1  Red  [0805 LED]
D3  SD560BTR  [SMB Diode]
D9  Red  [0805 LED]
F1  0ZCF0200AF2C  [2920]
GLV+_TP  0mm  [SMD Test Point]  (value not drawn)
GLV-_TP  0mm  [SMD Test Point]  (value not drawn)
R25  680R  [0805]
R26  510R  [0805]
U11  JTC0424S05  [24-DIP Module, 7 Leads]
U12  744273501  [Wurth 4-PC Pad]
U13  R2S-053.3/P  [RECOM 8-SMD (5 Pin)]

### Ports
GLV+, GLV-

### Nets
0V: 0V_TP.1 C33.1 R25.1 U11.16(-Vout) U13.1(-Vin)
0V (ISO): 0V_ISO_TP.1 C34.1 R26.1 U13.4(-Vout)
3.3V (ISO): 3.3V_ISO_TP.1 C34.2 D9.A U13.5(+Vout)
5V: 5V_TP.1 C33.2 D1.A U11.14(+Vout) U13.2(+Vin)
GLV+: F1.1 GLV+_TP.1 ; port GLV+
GLV-: C31.1 C32.1 C39.1 GLV-_TP.1 U12.1 ; port GLV-
NetC31_2: C31.2 C32.2 C39.2 D3.K U12.4
NetC40_1: C40.1 U11.2(-Vin) U11.3(-Vin) U12.2
NetC40_2: C40.2 U11.22(+Vin) U11.23(+Vin) U12.3
NetD1_K: D1.K R25.2
NetD3_A: D3.A F1.2
NetD9_K: D9.K R26.2

### Notes on the sheet
- VEHICLE
- SENSORS
- ISOLATED
- 10 kHz LP filter intended to mitigrate reflected input noise
- Title
- Size:
- Date:
- A4
- Number:
- Time:
- Revision:
- Sheet
- of
- File:

### Library data of the parts
0V_ISO_TP 0V_TP 3.3V_ISO_TP 5V_TP GLV+_TP GLV-_TP = SMD Test Point: as MUX_TP1 on sheet Multiplexer Bank; Part Number: SMD Test Point; Pitch: 0mm; Angle: 0
C31-C34 C39 C40 = CC1206MKX5R7BB226: Manufacturer: YAGEO; Tolerance: 20%; Material: Ceramic; Rated Voltage: 16V; Part Number: CC1206MKX5R7BB226; Value: 22uF; Digikey Part Number: 311-1997-2-ND
D1 D9 = SML-210LTT86: as D2 on sheet Microcontroller; Part Number: SML-210LTT86; Colour: Red; Digikey Part Number: 511-1286-1-ND; Digikey Link: https://www.digikey.com/product-detail/en/rohm-semiconductor/SML-210LTT86/511-1286-1-ND/637099
D3 = SD560BTR: 1.2V_F 600V 5A SMB; Manufacturer: SMC Diode Solutions; Part Number: SD560BTR; Digikey Part Number: 1655-1530-2-ND; Digikey Link: https://www.digikey.com/product-detail/en/smc-diode-solutions/SD560BTR/1655-1530-2-ND/6022620
F1 = 0ZCF0200AF2C: SMD 24V 2A Fuse; Manufacturer: Bel Fuse Inc; Part Number: 0ZCF0200AF2C; Digikey Part Number: 507-1749-2-ND; Digikey Link: https://www.digikey.com/product-detail/en/bel-fuse-inc/0ZCF0200AF2C/507-1749-2-ND/4156090
R25 = RC0805FR07680RL: as R6 on sheet Multiplexer Bank; Part Number: RC0805FR07680RL; Value: 680R; Material: FR-07
R26 = RC0805FR07510RL: as R30 on sheet Microcontroller; Part Number: RC0805FR07510RL; Value: 510R; Material: FR-07
U11 = JTC0424S05: DC DC CONVERTER 5V 4W; Manufacturer: XP Power; Input Voltage: 9V-36V; Efficiency: 0.79; Isolation: Isolated; Part Number: JTC0424S05; Output Voltage: 5V; Output Power: 4W; Digikey Part Number: JTC0424S05-ND; Digikey Link: https://www.digikey.com/products/en?keywords=%20JTC0424S05
U12 = 744273501: 5µH @ 100kHz 2 Line Common Mode Choke Surface Mount 500 Ohms @ 130MHz 5A DCR 5.5mOhm; Manufacturer: Wurth Electronics Inc; Part Number: 744273501; Inductance: 5µH @ 100kHz; Impedence: 500 Ohms @ 130MHz; Material: Wirewound; Rated Current: 5A; Digikey Part Number: 732-2214-6-ND; Digikey Link: https://www.digikey.com/product-detail/en/w-rth-elektronik/744273501/732-2214-6-ND/2175826
U13 = R2S-053.3/P: Isolated Module DC DC Converter 1 Output 3.3V 606mA 4.5V - 5.5V Input; Manufacturer: Recom; Output Power: 2W; Efficiency: 0.75; Part Number: R2S-053.3/P; Input Voltage: 4.5V-5.5V; Output Voltage: 3.3V; Isolation: Isolated; Digikey Part Number: 945-2677-5-ND; Digikey Link: https://www.digikey.com/product-detail/en/recom-power/R2S-053.3-P/945-2677-5-ND/2302804

## Nets that join several sheets
0V: Top Level (40 pins), U_4 Channel ADC (C14_U_4_Channel_ADC#1.1 U4_U_4_Channel_ADC#1.1 U4_U_4_Channel_ADC#1.3), U_Multiplexer Bank (11 pins), U_Multiplexer Bank (11 pins), U_Multiplexer Bank (11 pins), U_Multiplexer Bank (11 pins), U_Multiplexer Bank (11 pins), U_4 Channel ADC (C14_U_4_Channel_ADC#2.1 U4_U_4_Channel_ADC#2.3), Digital Isolation (8 pins), Power Supply (5 pins)
0V (ISO): Digital Isolation (C20.1 U6.4), Microcontroller (20 pins), Power Supply (0V_ISO_TP.1 C34.1 R26.1 U13.4)
3.3V (ISO): Digital Isolation (C20.2 R16.2 R17.2 U6.1), Microcontroller (17 pins), Power Supply (3.3V_ISO_TP.1 C34.2 D9.A U13.5)
5V: U_4 Channel ADC (C14_U_4_Channel_ADC#1.2 U4_U_4_Channel_ADC#1.8), U_Multiplexer Bank (11 pins), U_Multiplexer Bank (11 pins), U_Multiplexer Bank (11 pins), U_Multiplexer Bank (11 pins), U_Multiplexer Bank (11 pins), U_4 Channel ADC (C14_U_4_Channel_ADC#2.2 U4_U_4_Channel_ADC#2.1 U4_U_4_Channel_ADC#2.8), Digital Isolation (7 pins), Power Supply (5 pins)
A1: Top Level (P2.2), U_Multiplexer Bank (C15_U_Multiplexer_Bank#2.2 R6_U_Multiplexer_Bank#2.1 U5_U_Multiplexer_Bank#2.4)
A2: Top Level (P2.4), U_Multiplexer Bank (C16_U_Multiplexer_Bank#2.2 R7_U_Multiplexer_Bank#2.1 U5_U_Multiplexer_Bank#2.5)
A3: Top Level (P2.6), U_Multiplexer Bank (C17_U_Multiplexer_Bank#2.2 R8_U_Multiplexer_Bank#2.1 U5_U_Multiplexer_Bank#2.6)
A4: Top Level (P2.8), U_Multiplexer Bank (C18_U_Multiplexer_Bank#2.2 R9_U_Multiplexer_Bank#2.1 U5_U_Multiplexer_Bank#2.7)
A5: Top Level (P2.10), U_Multiplexer Bank (C35_U_Multiplexer_Bank#2.2 R10_U_Multiplexer_Bank#2.1 U5_U_Multiplexer_Bank#2.12)
A6: Top Level (P2.12), U_Multiplexer Bank (C36_U_Multiplexer_Bank#2.2 R11_U_Multiplexer_Bank#2.1 U5_U_Multiplexer_Bank#2.11)
A7: Top Level (P2.14), U_Multiplexer Bank (C37_U_Multiplexer_Bank#2.2 R12_U_Multiplexer_Bank#2.1 U5_U_Multiplexer_Bank#2.10)
A8: Top Level (P2.16), U_Multiplexer Bank (C38_U_Multiplexer_Bank#2.2 R13_U_Multiplexer_Bank#2.1 U5_U_Multiplexer_Bank#2.9)
B1: Top Level (P3.2), U_Multiplexer Bank (C15_U_Multiplexer_Bank#3.2 R6_U_Multiplexer_Bank#3.1 U5_U_Multiplexer_Bank#3.4)
B2: Top Level (P3.4), U_Multiplexer Bank (C16_U_Multiplexer_Bank#3.2 R7_U_Multiplexer_Bank#3.1 U5_U_Multiplexer_Bank#3.5)
B3: Top Level (P3.6), U_Multiplexer Bank (C17_U_Multiplexer_Bank#3.2 R8_U_Multiplexer_Bank#3.1 U5_U_Multiplexer_Bank#3.6)
B4: Top Level (P3.8), U_Multiplexer Bank (C18_U_Multiplexer_Bank#3.2 R9_U_Multiplexer_Bank#3.1 U5_U_Multiplexer_Bank#3.7)
B5: Top Level (P3.10), U_Multiplexer Bank (C35_U_Multiplexer_Bank#3.2 R10_U_Multiplexer_Bank#3.1 U5_U_Multiplexer_Bank#3.12)
B6: Top Level (P3.12), U_Multiplexer Bank (C36_U_Multiplexer_Bank#3.2 R11_U_Multiplexer_Bank#3.1 U5_U_Multiplexer_Bank#3.11)
B7: Top Level (P3.14), U_Multiplexer Bank (C37_U_Multiplexer_Bank#3.2 R12_U_Multiplexer_Bank#3.1 U5_U_Multiplexer_Bank#3.10)
B8: Top Level (P3.16), U_Multiplexer Bank (C38_U_Multiplexer_Bank#3.2 R13_U_Multiplexer_Bank#3.1 U5_U_Multiplexer_Bank#3.9)
C1: Top Level (P4.2), U_Multiplexer Bank (C15_U_Multiplexer_Bank#4.2 R6_U_Multiplexer_Bank#4.1 U5_U_Multiplexer_Bank#4.4)
C2: Top Level (P4.4), U_Multiplexer Bank (C16_U_Multiplexer_Bank#4.2 R7_U_Multiplexer_Bank#4.1 U5_U_Multiplexer_Bank#4.5)
C3: Top Level (P4.6), U_Multiplexer Bank (C17_U_Multiplexer_Bank#4.2 R8_U_Multiplexer_Bank#4.1 U5_U_Multiplexer_Bank#4.6)
C4: Top Level (P4.8), U_Multiplexer Bank (C18_U_Multiplexer_Bank#4.2 R9_U_Multiplexer_Bank#4.1 U5_U_Multiplexer_Bank#4.7)
C5: Top Level (P4.10), U_Multiplexer Bank (C35_U_Multiplexer_Bank#4.2 R10_U_Multiplexer_Bank#4.1 U5_U_Multiplexer_Bank#4.12)
C6: Top Level (P4.12), U_Multiplexer Bank (C36_U_Multiplexer_Bank#4.2 R11_U_Multiplexer_Bank#4.1 U5_U_Multiplexer_Bank#4.11)
C7: Top Level (P4.14), U_Multiplexer Bank (C37_U_Multiplexer_Bank#4.2 R12_U_Multiplexer_Bank#4.1 U5_U_Multiplexer_Bank#4.10)
C8: Top Level (P4.16), U_Multiplexer Bank (C38_U_Multiplexer_Bank#4.2 R13_U_Multiplexer_Bank#4.1 U5_U_Multiplexer_Bank#4.9)
D1: Top Level (P5.2), U_Multiplexer Bank (C15_U_Multiplexer_Bank#5.2 R6_U_Multiplexer_Bank#5.1 U5_U_Multiplexer_Bank#5.4)
D2: Top Level (P5.4), U_Multiplexer Bank (C16_U_Multiplexer_Bank#5.2 R7_U_Multiplexer_Bank#5.1 U5_U_Multiplexer_Bank#5.5)
D3: Top Level (P5.6), U_Multiplexer Bank (C17_U_Multiplexer_Bank#5.2 R8_U_Multiplexer_Bank#5.1 U5_U_Multiplexer_Bank#5.6)
D4: Top Level (P5.8), U_Multiplexer Bank (C18_U_Multiplexer_Bank#5.2 R9_U_Multiplexer_Bank#5.1 U5_U_Multiplexer_Bank#5.7)
D5: Top Level (P5.10), U_Multiplexer Bank (C35_U_Multiplexer_Bank#5.2 R10_U_Multiplexer_Bank#5.1 U5_U_Multiplexer_Bank#5.12)
D6: Top Level (P5.12), U_Multiplexer Bank (C36_U_Multiplexer_Bank#5.2 R11_U_Multiplexer_Bank#5.1 U5_U_Multiplexer_Bank#5.11)
D7: Top Level (P5.14), U_Multiplexer Bank (C37_U_Multiplexer_Bank#5.2 R12_U_Multiplexer_Bank#5.1 U5_U_Multiplexer_Bank#5.10)
D8: Top Level (P5.16), U_Multiplexer Bank (C38_U_Multiplexer_Bank#5.2 R13_U_Multiplexer_Bank#5.1 U5_U_Multiplexer_Bank#5.9)
E1: Top Level (P6.2), U_Multiplexer Bank (C15_U_Multiplexer_Bank#1.2 R6_U_Multiplexer_Bank#1.1 U5_U_Multiplexer_Bank#1.4)
E2: Top Level (P6.4), U_Multiplexer Bank (C16_U_Multiplexer_Bank#1.2 R7_U_Multiplexer_Bank#1.1 U5_U_Multiplexer_Bank#1.5)
E3: Top Level (P6.6), U_Multiplexer Bank (C17_U_Multiplexer_Bank#1.2 R8_U_Multiplexer_Bank#1.1 U5_U_Multiplexer_Bank#1.6)
E4: Top Level (P6.8), U_Multiplexer Bank (C18_U_Multiplexer_Bank#1.2 R9_U_Multiplexer_Bank#1.1 U5_U_Multiplexer_Bank#1.7)
E5: Top Level (P6.10), U_Multiplexer Bank (C35_U_Multiplexer_Bank#1.2 R10_U_Multiplexer_Bank#1.1 U5_U_Multiplexer_Bank#1.12)
E6: Top Level (P6.12), U_Multiplexer Bank (C36_U_Multiplexer_Bank#1.2 R11_U_Multiplexer_Bank#1.1 U5_U_Multiplexer_Bank#1.11)
E7: Top Level (P6.14), U_Multiplexer Bank (C37_U_Multiplexer_Bank#1.2 R12_U_Multiplexer_Bank#1.1 U5_U_Multiplexer_Bank#1.10)
E8: Top Level (P6.16), U_Multiplexer Bank (C38_U_Multiplexer_Bank#1.2 R13_U_Multiplexer_Bank#1.1 U5_U_Multiplexer_Bank#1.9)
GLV+: Top Level (P1.1), Power Supply (F1.1 GLV+_TP.1)
GLV-: Top Level (P1.2), Power Supply (5 pins)
NetMUX_TP1_U_Multiplexer_Bank#1_1: U_4 Channel ADC (U4_U_4_Channel_ADC#1.5), U_Multiplexer Bank (MUX_TP1_U_Multiplexer_Bank#1.1 U5_U_Multiplexer_Bank#1.8)
NetMUX_TP1_U_Multiplexer_Bank#2_1: U_Multiplexer Bank (MUX_TP1_U_Multiplexer_Bank#2.1 U5_U_Multiplexer_Bank#2.8), U_4 Channel ADC (U4_U_4_Channel_ADC#2.4)
NetMUX_TP1_U_Multiplexer_Bank#3_1: U_Multiplexer Bank (MUX_TP1_U_Multiplexer_Bank#3.1 U5_U_Multiplexer_Bank#3.8), U_4 Channel ADC (U4_U_4_Channel_ADC#2.5)
NetMUX_TP1_U_Multiplexer_Bank#4_1: U_Multiplexer Bank (MUX_TP1_U_Multiplexer_Bank#4.1 U5_U_Multiplexer_Bank#4.8), U_4 Channel ADC (U4_U_4_Channel_ADC#2.6)
NetMUX_TP1_U_Multiplexer_Bank#5_1: U_4 Channel ADC (U4_U_4_Channel_ADC#1.4), U_Multiplexer Bank (MUX_TP1_U_Multiplexer_Bank#5.1 U5_U_Multiplexer_Bank#5.8)
PB6: Digital Isolation (R15.1 SCL_TP.1 U6.6), Microcontroller (U10.42)
PB7: Digital Isolation (R14.1 SDA_TP.1 U6.7), Microcontroller (U10.43)
PB13: Digital Isolation (R18.1 SEL0_ISO_TP.1), Microcontroller (U10.26)
PB14: Digital Isolation (R21.1 SEL1_ISO_TP.1), Microcontroller (U10.27)
PB15: Digital Isolation (R24.1 SEL2_ISO_TP.1), Microcontroller (U10.28)
SCL: U_4 Channel ADC (U4_U_4_Channel_ADC#1.10), U_4 Channel ADC (U4_U_4_Channel_ADC#2.10), Digital Isolation (R17.1 SCL_ISO_TP.1 U6.3)
SDA: U_4 Channel ADC (U4_U_4_Channel_ADC#1.9), U_4 Channel ADC (U4_U_4_Channel_ADC#2.9), Digital Isolation (R16.1 SDA_ISO_TP.1 U6.2)
SEL0: U_Multiplexer Bank (U5_U_Multiplexer_Bank#1.1), U_Multiplexer Bank (U5_U_Multiplexer_Bank#2.1), U_Multiplexer Bank (U5_U_Multiplexer_Bank#3.1), U_Multiplexer Bank (U5_U_Multiplexer_Bank#4.1), U_Multiplexer Bank (U5_U_Multiplexer_Bank#5.1), Digital Isolation (R19.2 SEL0_TP.1 U7.3)
SEL1: U_Multiplexer Bank (U5_U_Multiplexer_Bank#1.16), U_Multiplexer Bank (U5_U_Multiplexer_Bank#2.16), U_Multiplexer Bank (U5_U_Multiplexer_Bank#3.16), U_Multiplexer Bank (U5_U_Multiplexer_Bank#4.16), U_Multiplexer Bank (U5_U_Multiplexer_Bank#5.16), Digital Isolation (R20.2 SEL1_TP.1 U8.3)
SEL2: U_Multiplexer Bank (U5_U_Multiplexer_Bank#1.15), U_Multiplexer Bank (U5_U_Multiplexer_Bank#2.15), U_Multiplexer Bank (U5_U_Multiplexer_Bank#3.15), U_Multiplexer Bank (U5_U_Multiplexer_Bank#4.15), U_Multiplexer Bank (U5_U_Multiplexer_Bank#5.15), Digital Isolation (R22.2 SEL2_TP.1 U9.3)